# Altium project ESPMovementDetector.PrjPCB
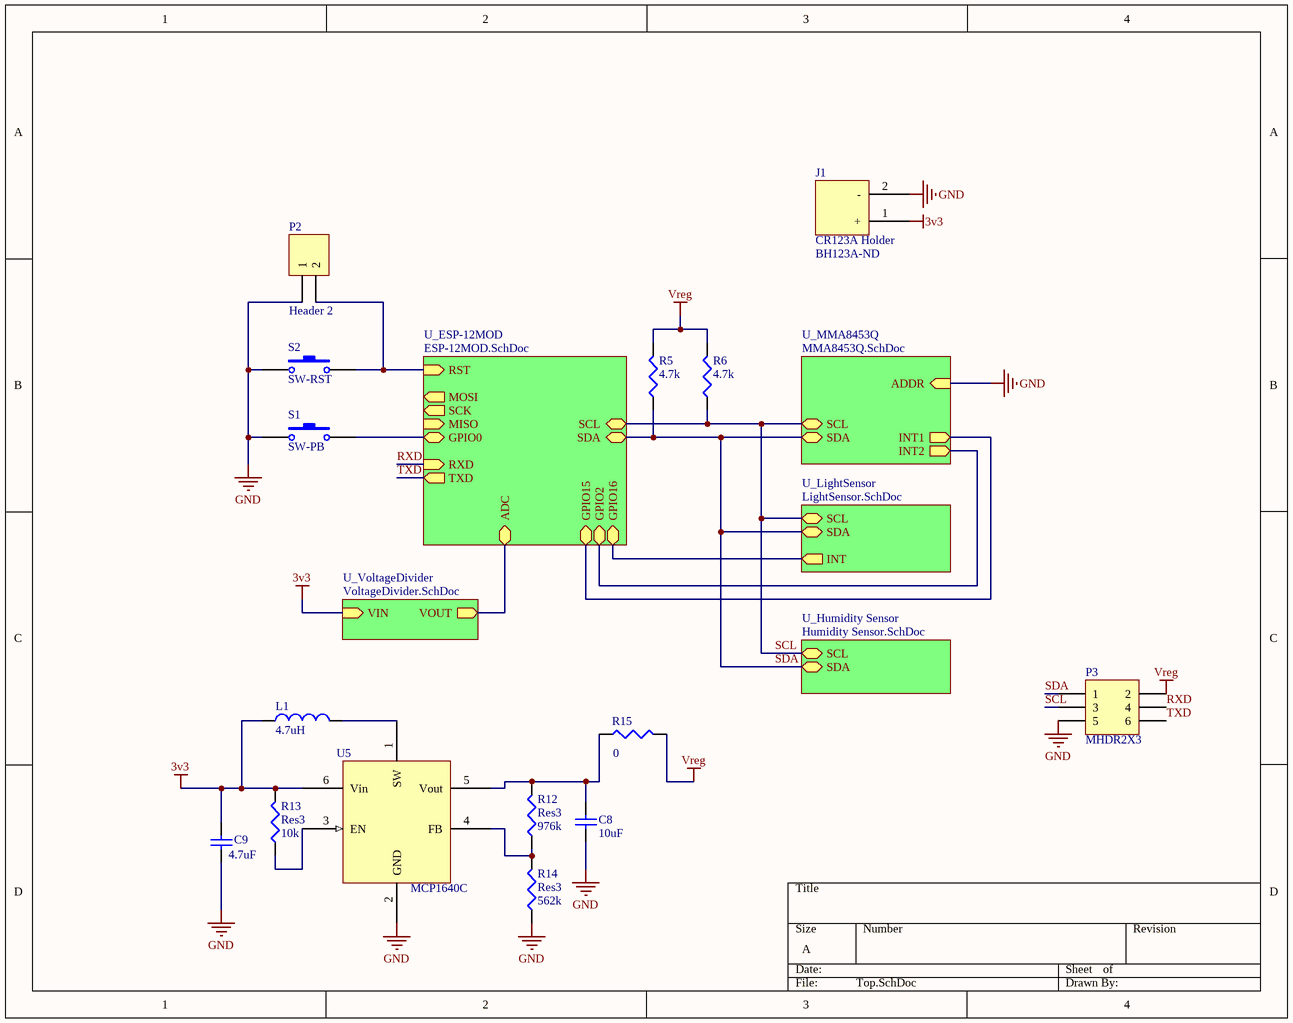
[diagram p0: Top.SchDoc]
6 sheets, 38 parts. Net scope: hierarchical (ports join the sheet entries above them; power ports are global).
Board file: ESPMovementDetector.PcbDoc
Sheets:
  Top.SchDoc
    U_MMA8453Q = MMA8453Q.SchDoc
    U_LightSensor = LightSensor.SchDoc
    U_ESP-12MOD = ESP-12MOD.SchDoc
    U_VoltageDivider = VoltageDivider.SchDoc
    U_Humidity Sensor = Humidity Sensor.SchDoc

## Sheet Top.SchDoc
size A

### Parts
C8  value 10uF  [C0805]  (hidden comment: Cap)
C9  value 4.7uF  [C0805]  (hidden comment: Cap)
J1  CR123A Holder  Supplier Part Number 1: BH123A-ND  [BHA123A]
L1  value 4.7uH  [6.3mmx6.3mm Inductor]  (hidden comment: Inductor)
P2  Header 2  [HDR1X2]
P3  MHDR2X3  [MHDR2X3]
R5  value 4.7k  [J1-0603]  (hidden comment: Res3)
R6  value 4.7k  [J1-0603]  (hidden comment: Res3)
R12  Res3  value 976k  [J1-0603]
R13  Res3  value 10k  [J1-0603]
R14  Res3  value 562k  [J1-0603]
R15  value 0  [J1-0603]  (hidden comment: Res3)
S1  SW-PB  [SMD SPST Tactile Switch]
S2  SW-RST  [SMD SPST Tactile Switch]
U5  MCP1640C  [SOT-23 MCP1640]

### Sub-sheets
U_ESP-12MOD = ESP-12MOD.SchDoc: RST (in), RXD (in), TXD (out), ADC (bidir), SCL (bidir), SDA (bidir), SCK (out), MISO (in), MOSI (out), GPIO16 (bidir), GPIO2 (bidir), GPIO15 (bidir), GPIO0 (bidir)
U_Humidity Sensor = Humidity Sensor.SchDoc: SDA (bidir), SCL (bidir)
U_LightSensor = LightSensor.SchDoc: SCL (bidir), SDA (bidir), INT (out)
U_MMA8453Q = MMA8453Q.SchDoc: SCL (bidir), SDA (bidir), ADDR (in), INT1 (out), INT2 (out)
U_VoltageDivider = VoltageDivider.SchDoc: VIN (in), VOUT (out)

### Nets
3v3: C9.2 J1.1(+) L1.1 R13.2 U5.6(Vin) ; sheet U_VoltageDivider/VIN
GND: C8.1 C9.1 J1.2(-) P2.1 P3.5 R14.1 S1.1 S2.1 U5.2(GND) ; sheet U_MMA8453Q/ADDR
Vreg: P3.2 R5.2 R6.2 R15.2
DTR: S1.2 ; sheet U_ESP-12MOD/GPIO0
ESP_RST: P2.2 S2.2 ; sheet U_ESP-12MOD/RST
RXD: P3.4 ; sheet U_ESP-12MOD/RXD  [project net ESP_RX]
SCL: P3.3 R6.1 ; sheet U_MMA8453Q/SCL, sheet U_LightSensor/SCL, sheet U_ESP-12MOD/SCL, sheet U_Humidity Sensor/SCL
SDA: P3.1 R5.1 ; sheet U_MMA8453Q/SDA, sheet U_LightSensor/SDA, sheet U_ESP-12MOD/SDA, sheet U_Humidity Sensor/SDA
TXD: P3.6 ; sheet U_ESP-12MOD/TXD  [project net ESP_TX]
NetC8_2: C8.2 R12.2 R15.1 U5.5(Vout)
NetL1_2: L1.2 U5.1(SW)
NetR4_2: sheet U_MMA8453Q/INT1, sheet U_ESP-12MOD/GPIO15
NetR7_1: sheet U_ESP-12MOD/ADC, sheet U_VoltageDivider/VOUT
NetR10_2: sheet U_LightSensor/INT, sheet U_ESP-12MOD/GPIO16
NetR12_1: R12.1 R14.2 U5.4(FB)
NetR13_1: R13.1 U5.3(EN)
NetU1_11: sheet U_MMA8453Q/INT2, sheet U_ESP-12MOD/GPIO2

### Library data of the parts
C8 C9 = Cap: Capacitor; Published: 8-Jun-2000; LatestRevisionDate: 17-Jul-2002; LatestRevisionNote: Re-released for DXP Platform.; PackageReference: RAD-0.3; Publisher: Altium Limited; PackageDescription: Radial Cap, Thru-Hole; 2 Leads; 0.3 in Pin Spacing; Supplier 1: Digi-Key
  C8: Supplier Part Number 1: 587-1312-1-ND
  C9: Supplier Part Number 1: 311-1371-1-ND
L1 = Inductor: Code_IEC: 1005; Published: 8-Jun-2000; LatestRevisionDate: 29-May-2009; LatestRevisionNote: IPC-7351 Footprint Added.; PackageReference: 0402-A; Publisher: Altium Limited; PackageDescription: Chip Inductor; Code_JEITA: 0402; Supplier 1: Digi-Key; Supplier Part Number 1: 495-1997-1-ND
P2 = Header 2: Header, 2-Pin; LatestRevisionDate: 17-Jul-2002; LatestRevisionNote: Re-released for DXP Platform.; Publisher: Altium Limited
P3 = MHDR2X3: Header, 3-Pin, Dual row; LatestRevisionDate: 17-Jul-2002; LatestRevisionNote: Re-released for DXP Platform.; Publisher: Altium Limited
R5 R6 R12-R15 = Res3: Resistor; Published: 8-Jun-2000; LatestRevisionDate: 29-May-2009; LatestRevisionNote: IPC-7351 Footprint Added.; PackageReference: J1-0603; Publisher: Altium Limited; PackageDescription: Chip Resistor
S1 S2 = SW-PB: Switch; pin to pad: 2>3; Published: 24-Mar-1999; LatestRevisionDate: 17-Jul-2002; LatestRevisionNote: Re-released for DXP Platform.; PackageReference: SPST-2; Publisher: Altium Limited; PackageDescription: Switch; 2 Leads; Supplier 1: Digi-Key; Supplier Part Number 1: CKN9112CT-ND
U5 = MCP1640C: Synchronous Boost converter 100mA; Supplier 1: Digi-Key; Supplier Part Number 1: MCP1640CT-I/CHYDKR-ND
J1 = CR123A Holder: Supplier 1: Digi-Key

## Sheet MMA8453Q.SchDoc
size A
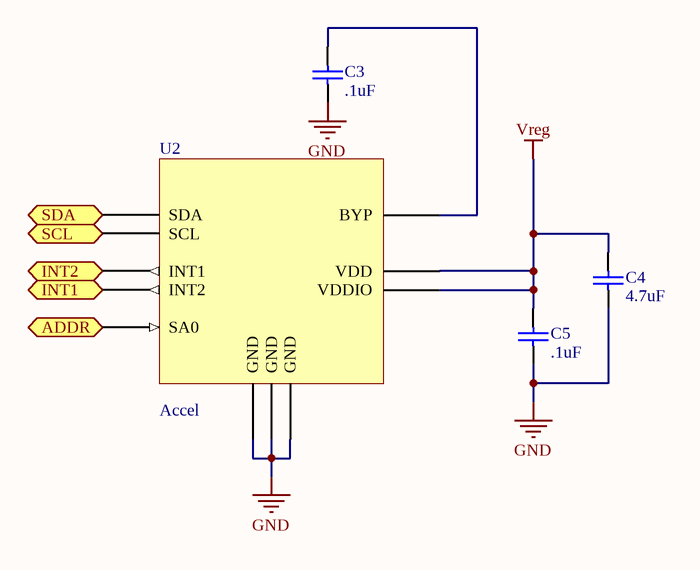
[diagram p1: MMA8453Q.SchDoc]

### Parts
C3  value .1uF  [1608[0603]]  (hidden comment: Cap)
C4  value 4.7uF  [1608[0603]]  (hidden comment: Cap)
C5  value .1uF  [1608[0603]]  (hidden comment: Cap)
U2  Accel  [QFN16 3x3mm 5x3 pin]

### Ports
ADDR (in), INT1 (out), INT2 (out), SCL (bidir), SDA (bidir)

### Nets
GND: C3.1 C4.1 C5.1 U2.5(GND) U2.7(SA0) U2.10(GND) U2.12(GND) ; port ADDR
Vreg: C4.2 C5.2 U2.1(VDDIO) U2.14(VDD)
SCL: U2.4(SCL) ; port SCL
SDA: U2.6(SDA) ; port SDA
NetC3_2: C3.2 U2.2(BYP)
NetR4_2: U2.9(INT2) ; port INT1
NetU1_11: U2.11(INT1) ; port INT2

### Library data of the parts
C3-C5 = Cap Semi: Capacitor; Published: 8-Jun-2000; LatestRevisionDate: 29-May-2009; LatestRevisionNote: IPC-7351 Footprint Added.; PackageReference: C1206; Publisher: Altium Limited; PackageDescription: Chip Capacitor
U2 = MMA8453Q: 3 Axis I2C Ultra Low Power Accelerometer; Manufacturer: Freescale Semiconductor; Manufacturer Part Number: MMA8453QR1; Axis: X, Y, Z; Acceleration Range: ±2g, 4g, 8g; Sensitivity: 256LSB/g, 128LSB/g, 64LSB/g; Voltage - Supply: 1.95 V ~ 3.6 V; Output Type: I²C; Bandwidth: 800Hz; Interface: Serial; Supplier 1: Digi-Key; Supplier Part Number 1: MMA8453QR1CT-ND; RoHS: RoHS Compliant; Category: Sensors, Transducers; Stock 1: 5993; Pricing 1: 1=1.43, 10=1.275, 25=1.1984, 100=1.1475, 250=1.09652, 500=1.02 (USD); Packaging: Cut Tape (CT); Mounting Type: Surface Mount; Package / Case: 16-VFQFN; Supplier Device Package: 16-QFN (3x3); ComponentLink1URL: http://cache.freescale.com/files/sensors/doc/data_sheet/MMA8453Q.pdf; ComponentLink1Description: http://cache.freescale.com/files/sensors/doc/data_sheet/MMA8453Q.pdf

## Sheet LightSensor.SchDoc: Nitrogen Generic Sensor
size A4; Author: Michael Kapuscik; Engineer: Michael Kapuscik; SheetNumber: 1
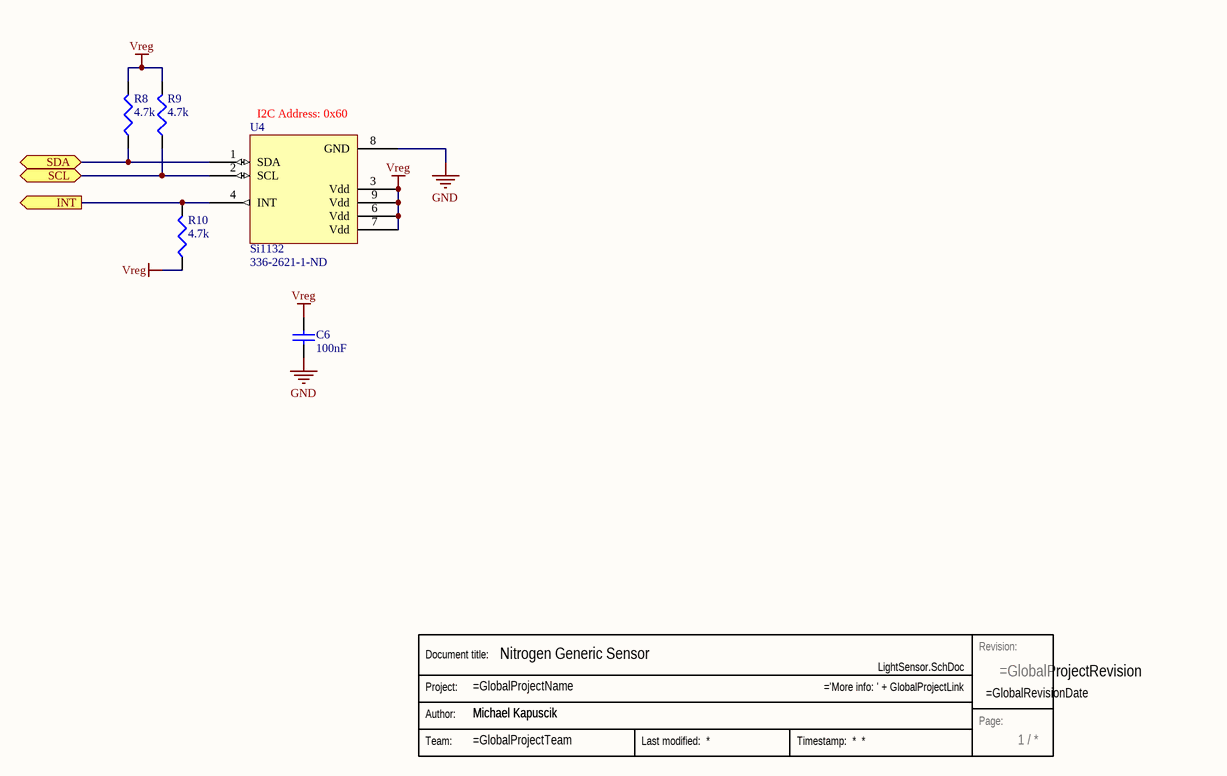
[diagram p2: LightSensor.SchDoc]

### Parts
(Parts that share a designator on the sheet are numbered #1, #2 ... from top to bottom, then left to right.)
C6  value 100nF  [1608[0603]]  (hidden comment: Cap)
R8  value 4.7k  [J1-0603]  (hidden comment: Res3)
R9  value 4.7k  [J1-0603]  (hidden comment: Res3)
R10  value 4.7k  [J1-0603]  (hidden comment: Res3)
Stamp#1  Stamp  (value not drawn)  (graphical)
U4  Si1132  Supplier Part Number 1: 336-2621-1-ND  [QFN10 2x2 Si1132]

### Ports
INT (out), SCL (bidir), SDA (bidir)

### Nets
GND: C6.1 U4.8(GND)
Vreg: C6.2 R8.2 R9.2 R10.1 U4.3(Vdd) U4.6(Vdd) U4.7(Vdd) U4.9(Vdd)
SCL: R9.1 U4.2(SCL) ; port SCL
SDA: R8.1 U4.1(SDA) ; port SDA
NetR10_2: R10.2 U4.4(INT) ; port INT

### Notes on the sheet
- (near U4) I2C Address: 0x60
- (in symbol Stamp) Revision:; Document title:; Project:; Author:; Page:; Team:

### Library data of the parts
C6 = Cap Semi: Capacitor (Semiconductor SIM Model); Published: 8-Jun-2000; LatestRevisionDate: 29-May-2009; LatestRevisionNote: IPC-7351 Footprint Added.; PackageReference: C1206; Publisher: Altium Limited; PackageDescription: Chip Capacitor
R8-R10 = Res3: Resistor; Published: 8-Jun-2000; LatestRevisionDate: 29-May-2009; LatestRevisionNote: IPC-7351 Footprint Added.; PackageReference: J1-0603; Publisher: Altium Limited; PackageDescription: Chip Resistor
U4 = Si1132: Supplier 1: Digi-Key

## Sheet ESP-12MOD.SchDoc
size A
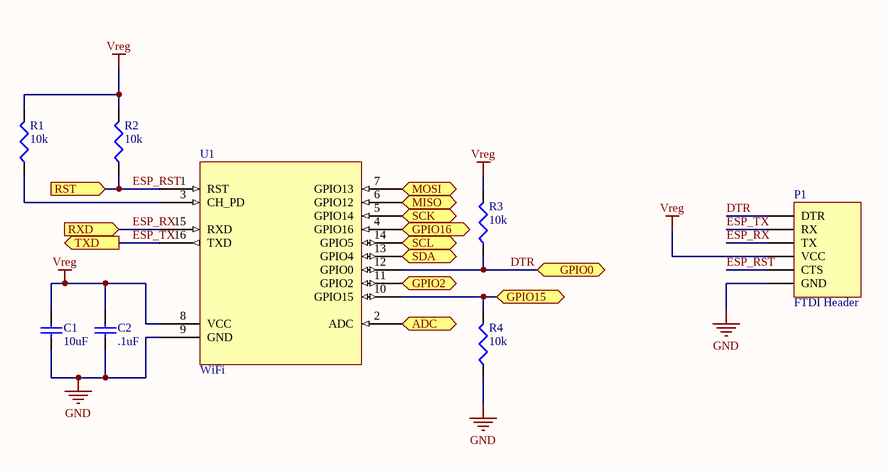
[diagram p3: ESP-12MOD.SchDoc]

### Parts
C1  value 10uF  [1608[0603]]  (hidden comment: Cap)
C2  value .1uF  [1608[0603]]  (hidden comment: Cap)
P1  FTDI Header  [HDR1X6]
R1  value 10k  [J1-0603]  (hidden comment: Res3)
R2  value 10k  [J1-0603]  (hidden comment: Res3)
R3  value 10k  [J1-0603]  (hidden comment: Res3)
R4  value 10k  [J1-0603]  (hidden comment: Res3)
U1  WiFi  [ESP8266ShieldedSMD]

### Ports
ADC (bidir), GPIO0 (bidir), GPIO2 (bidir), GPIO15 (bidir), GPIO16 (bidir), MISO (in), MOSI (out), RST (in), RXD (in), SCK (out), SCL (bidir), SDA (bidir), TXD (out)

### Nets
GND: C1.1 C2.1 P1.6(GND) R4.1 U1.9(GND)
Vreg: C1.2 C2.2 P1.4(VCC) R1.2 R2.2 R3.2 U1.8(VCC)
DTR: P1.1(DTR) R3.1 U1.12(GPIO0) ; port GPIO0
ESP_RST: P1.5(CTS) R2.1 U1.1(RST) ; port RST
ESP_RX: P1.3(TX) U1.15(RXD) ; port RXD
ESP_TX: P1.2(RX) U1.16(TXD) ; port TXD
SCL: U1.14(GPIO5) ; port SCL
SDA: U1.13(GPIO4) ; port SDA
NetR1_1: R1.1 U1.3(CH_PD)
NetR4_2: R4.2 U1.10(GPIO15) ; port GPIO15
NetR7_1: U1.2(ADC) ; port ADC
NetR10_2: U1.4(GPIO16) ; port GPIO16
NetU1_5: U1.5(GPIO14) ; port SCK
NetU1_6: U1.6(GPIO12) ; port MISO
NetU1_7: U1.7(GPIO13) ; port MOSI
NetU1_11: U1.11(GPIO2) ; port GPIO2

### Library data of the parts
C1 C2 = Cap Semi: Published: 8-Jun-2000; LatestRevisionDate: 29-May-2009; LatestRevisionNote: IPC-7351 Footprint Added.; PackageReference: C1206; Publisher: Altium Limited; PackageDescription: Chip Capacitor
P1 = FTDI Header: Header, 6-Pin; LatestRevisionDate: 17-Jul-2002; LatestRevisionNote: Re-released for DXP Platform.; Publisher: Altium Limited
R1-R4 = Res3: Resistor; Published: 8-Jun-2000; LatestRevisionDate: 29-May-2009; LatestRevisionNote: IPC-7351 Footprint Added.; PackageReference: J1-0603; Publisher: Altium Limited; PackageDescription: Chip Resistor
U1 = ESP8266-Shielded

## Sheet VoltageDivider.SchDoc
size A
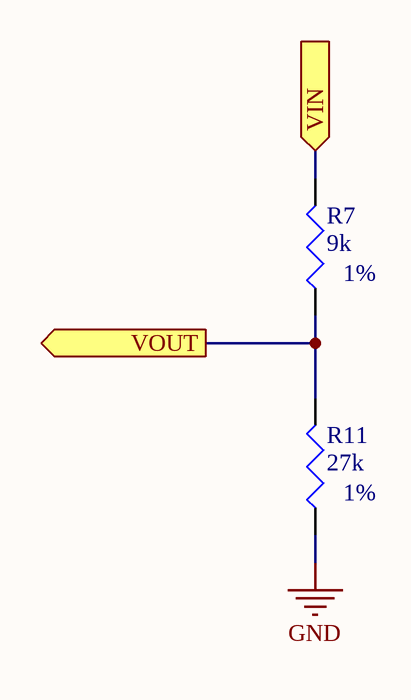
[diagram p4: VoltageDivider.SchDoc]

### Parts
R7  1%  value 9k  [J1-0603]
R11  1%  value 27k  [J1-0603]

### Ports
VIN (in), VOUT (out)

### Nets
3v3: R7.2 ; port VIN
GND: R11.1
NetR7_1: R7.1 R11.2 ; port VOUT

### Library data of the parts
R7 R11 = Res3: Resistor; Published: 8-Jun-2000; LatestRevisionDate: 29-May-2009; LatestRevisionNote: IPC-7351 Footprint Added.; PackageReference: J1-0603; Publisher: Altium Limited; PackageDescription: Chip Resistor; Supplier 1: Digi-Key
  R7: Supplier Part Number 1: 311-9.10KHRCT-ND
  R11: Supplier Part Number 1: MCT0603-27.0K-CFCT-ND

## Sheet Humidity Sensor.SchDoc: Nitrogen Generic Sensor
size A4; Author: Michael Kapuscik; Engineer: Michael Kapuscik; SheetNumber: 1
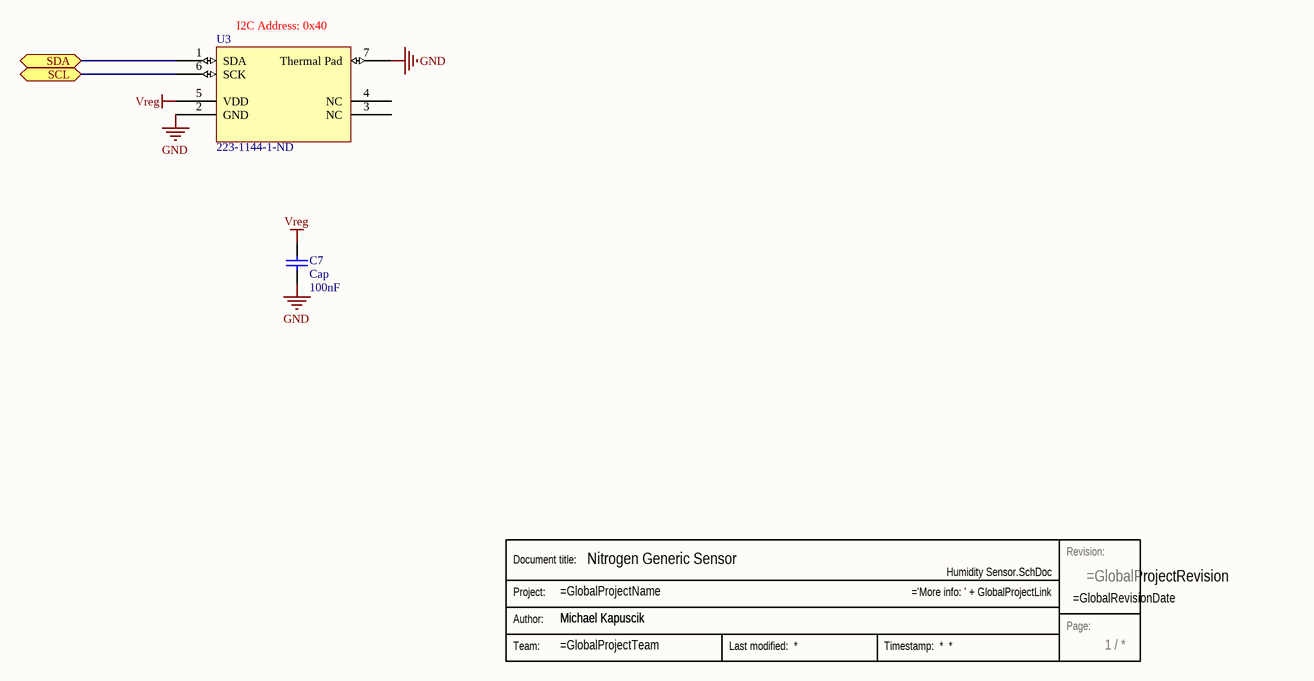
[diagram p5: Humidity Sensor.SchDoc]

### Parts
(Parts that share a designator on the sheet are numbered #1, #2 ... from top to bottom, then left to right.)
C7  Cap  value 100nF  [1608[0603]]
Stamp#2  Stamp  (value not drawn)  (graphical)
U3  Supplier Part Number 1: 223-1144-1-ND  [DFN6 3x3 HTU21D Ambient Measurement]  (hidden comment: I2C Humidity Sensor)

### Ports
SCL (bidir), SDA (bidir)

### Nets
GND: C7.1 U3.2(GND) U3.7(Thermal_Pad)
Vreg: C7.2 U3.5(VDD)
SCL: U3.6(SCK) ; port SCL
SDA: U3.1(SDA) ; port SDA

Not connected (* = marked no-connect by the designer): U3 3(NC) 4(NC)

### Notes on the sheet
- (near U3) I2C Address: 0x40
- (in symbol Stamp) Revision:; Document title:; Project:; Author:; Page:; Team:

### Library data of the parts
C7 = Cap Semi: Capacitor (Semiconductor SIM Model); Published: 8-Jun-2000; LatestRevisionDate: 29-May-2009; LatestRevisionNote: IPC-7351 Footprint Added.; PackageReference: C1206; Publisher: Altium Limited; PackageDescription: Chip Capacitor
U3 = HTU21D-F: Supplier 1: Digi-Key

## Nets that join several sheets
3v3: Top (5 pins), VoltageDivider (R7.2)
GND: Top (9 pins), MMA8453Q (7 pins), LightSensor (C6.1 U4.8), ESP-12MOD (5 pins), VoltageDivider (R11.1), Humidity Sensor (C7.1 U3.2 U3.7)
Vreg: Top (P3.2 R5.2 R6.2 R15.2), MMA8453Q (C4.2 C5.2 U2.1 U2.14), LightSensor (8 pins), ESP-12MOD (7 pins), Humidity Sensor (C7.2 U3.5)
DTR: Top (S1.2), ESP-12MOD (P1.1 R3.1 U1.12)
ESP_RST: Top (P2.2 S2.2), ESP-12MOD (P1.5 R2.1 U1.1)
ESP_RX: Top (P3.4), ESP-12MOD (P1.3 U1.15)
ESP_TX: Top (P3.6), ESP-12MOD (P1.2 U1.16)
NetR4_2: MMA8453Q (U2.9), ESP-12MOD (R4.2 U1.10)
NetR7_1: ESP-12MOD (U1.2), VoltageDivider (R7.1 R11.2)
NetR10_2: LightSensor (R10.2 U4.4), ESP-12MOD (U1.4)
NetU1_11: MMA8453Q (U2.11), ESP-12MOD (U1.11)
SCL: Top (P3.3 R6.1), MMA8453Q (U2.4), LightSensor (R9.1 U4.2), ESP-12MOD (U1.14), Humidity Sensor (U3.6)
SDA: Top (P3.1 R5.1), MMA8453Q (U2.6), LightSensor (R8.1 U4.1), ESP-12MOD (U1.13), Humidity Sensor (U3.1)